# EAGLE design bus_breakout (EAGLE 6.1)
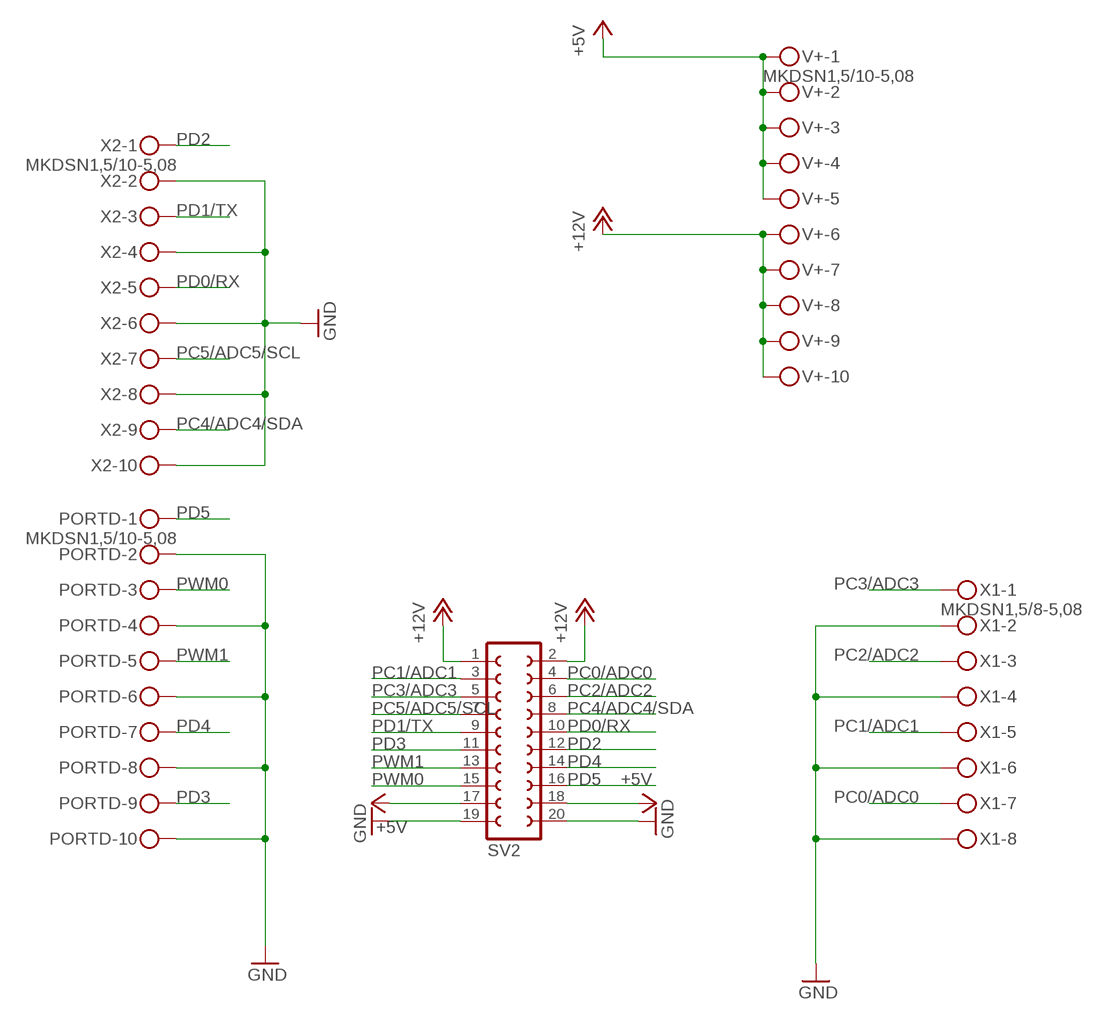
[diagram p0: schematic, sheet 1]

## Parts
PORTD  MKDSN1,5/10-5,08  [MKDSN1,5/10-5,08]
SV2  FE10-2  [FE10-2]
V+  MKDSN1,5/10-5,08  [MKDSN1,5/10-5,08]
X1  MKDSN1,5/8-5,08  [MKDSN1,5/8-5,08]
X2  MKDSN1,5/10-5,08  [MKDSN1,5/10-5,08]

## Nets
+5V: SV2.17 SV2.18 V+.1 V+.2 V+.3 V+.4 V+.5
+12V: SV2.1 SV2.2 V+.6 V+.7 V+.8 V+.9 V+.10
GND: PORTD.2 PORTD.4 PORTD.6 PORTD.8 PORTD.10 SV2.19 SV2.20 X1.2 X1.4 X1.6 X1.8 X2.2 X2.4 X2.6 X2.8 X2.10
PC0/ADC0: SV2.4 X1.7
PC1/ADC1: SV2.3 X1.5
PC2/ADC2: SV2.6 X1.3
PC3/ADC3: SV2.5 X1.1
PC4/ADC4/SDA: SV2.8 X2.9
PC5/ADC5/SCL: SV2.7 X2.7
PD0/RX: SV2.10 X2.5
PD1/TX: SV2.9 X2.3
PD2: SV2.12 X2.1
PD3: PORTD.9 SV2.11
PD4: PORTD.7 SV2.14
PD5: PORTD.1 SV2.16
PWM0: PORTD.3 SV2.15
PWM1: PORTD.5 SV2.13

## Library data of the parts
PORTD V+ X2 = con-phoenix-508:MKDSN1,5/10-5,08: MKDSN 1,5/10-5,08 Printklemme Nennstrom: 13,5 A Nennspannung: 250 V Rastermaß: 5,08 mm Polzahl: 10 Anschlussart: Schraubanschluss Montage: Löten Anschlussrichtung Leiter/Platine: 0 ° Artikelnummer: 1729209 Source: http://eshop.phoenixcontact.com .. 1729209.pdf; MPN: SMKDSN1,5/10-5,08; OC_FARNELL: 1792913; OC_NEWARK: 70R0297
SV2 = con-lsta:FE10-2: FEMALE HEADER; OC_FARNELL: unknown; OC_NEWARK: unknown
X1 = con-phoenix-508:MKDSN1,5/8-5,08: MKDSN 1,5/ 8-5,08 Printklemme Nennstrom: 13,5 A Nennspannung: 250 V Rastermaß: 5,08 mm Polzahl: 8 Anschlussart: Schraubanschluss Montage: Löten Anschlussrichtung Leiter/Platine: 0 ° Artikelnummer: 1729186 Source: http://eshop.phoenixcontact.com .. 1729186.pdf; MPN: SMKDSN1,5/8-5,08; OC_FARNELL: 1792911; OC_NEWARK: 70R0304

## Board
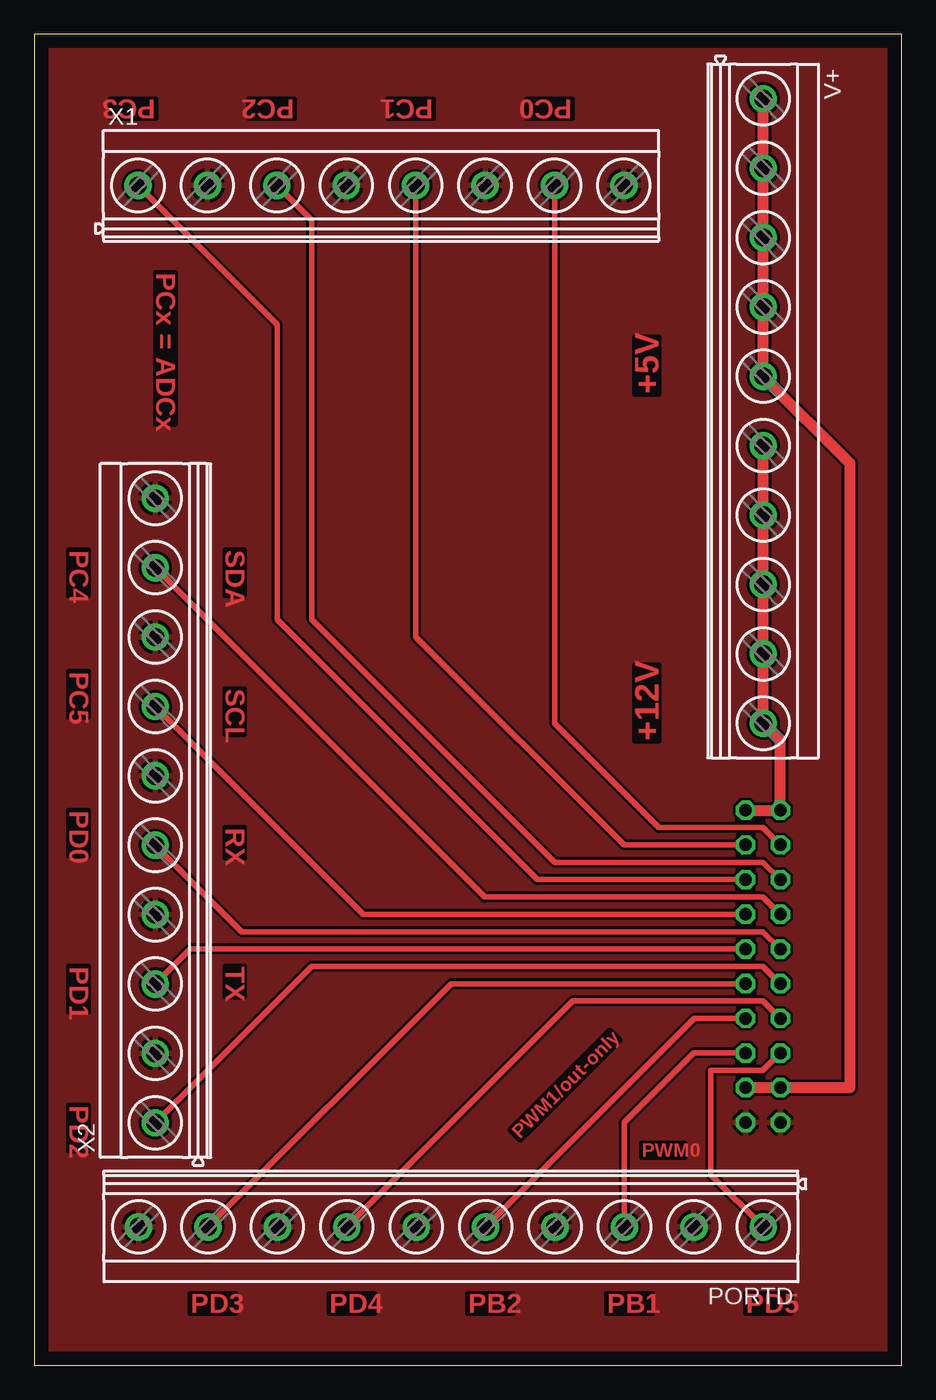
[diagram p1: board, top side]
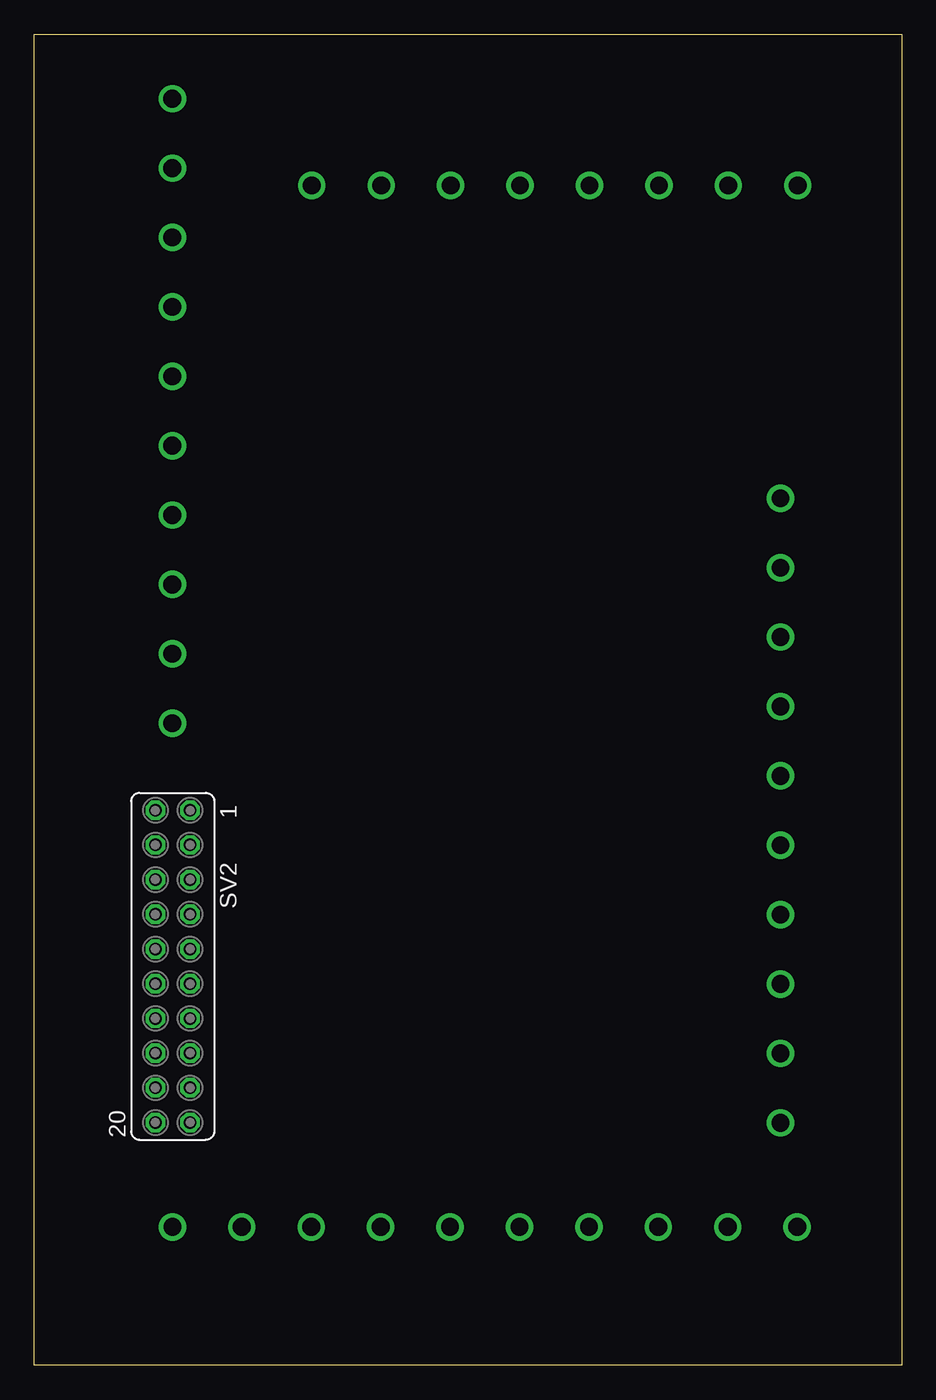
[diagram p2: board, bottom side, seen from below]

Size 63.48 x 97.46 mm. Coordinates in mm from the lower left corner, seen from the top.
Outline: 0,0 63.48,0 63.48,97.46 0,97.46 0,0
Copper layers (1*16): Top 0.035mm / dielectric 1.5mm / Bottom 0.035mm
Design rules: minimum track width 10mil, minimum drill 24mil, track to track 8mil, track to pad 8mil, pad to pad 8mil, via to via 8mil, smd to smd 8mil, copper to edge 40mil, drill to drill 8mil, minimum pad ring 10mil, minimum via ring 8mil, stop-mask expansion 4mil, vias tented up to drill 0mil, thermal gap 10mil

### Footprints (pad centres in the part's own frame; a part is rotated, then mirrored left to right if it is on the bottom)
MKDSN1,5/10-5,08 = drill 1.3 pad 2: 1 -22.881,0.025; 2 -17.801,0.025; 3 -12.721,0.025; 4 -7.641,0.025; 5 -2.561,0.025; 6 2.519,0.025; 7 7.599,0.025; 8 12.679,0.025; 9 17.759,0.025; 10 22.839,0.025
FE10-2 = drill 0.914 octagon: 1 -11.43,1.27; 2 -11.43,-1.27; 3 -8.89,1.27; 4 -8.89,-1.27; 5 -6.35,1.27; 6 -6.35,-1.27; 7 -3.81,1.27; 8 -3.81,-1.27; 9 -1.27,1.27; 10 -1.27,-1.27; 11 1.27,1.27; 12 1.27,-1.27; 13 3.81,1.27; 14 3.81,-1.27; 15 6.35,1.27; 16 6.35,-1.27; 17 8.89,1.27; 18 8.89,-1.27; 19 11.43,1.27; 20 11.43,-1.27
MKDSN1,5/8-5,08 = drill 1.3 pad 2: 1 -17.801,0.025; 2 -12.721,0.025; 3 -7.641,0.025; 4 -2.561,0.025; 5 2.519,0.025; 6 7.599,0.025; 7 12.679,0.025; 8 17.759,0.025

### Placement (x,y rotation side)
PORTD  30.48,10.16 180 top
SV2  53.34,29.21 270 bottom
V+  53.34,69.85 270 top
X1  25.4,86.36 0 top
X2  8.89,40.64 90 top

### Tracks (layer width: path | path; a pad name or v marks a point on that pad's centre or on a via)
+5V
  Top 0.813: SV2.17 SV2.18 59.69,20.32 59.69,66.04 53.37,72.36 V+.5 V+.4 V+.3 V+.2 V+.1
+12V
  Top 0.813: SV2.1 SV2.2 54.61,45.77 V+.10 V+.9 V+.8 V+.7 V+.6
GND
  pour Top: -1.27,100.33 -1.27,-1.27 66.04,-1.27 66.04,100.33
PC0/ADC0
  Top 0.406: SV2.4 53.34,39.37 45.72,39.37 38.1,46.99 38.1,86.36 X1.7
PC1/ADC1
  Top 0.406: SV2.3 43.18,38.1 27.94,53.34 27.94,86.36 X1.5
PC2/ADC2
  Top 0.406: SV2.6 53.34,36.83 38.1,36.83 20.32,54.61 20.32,83.82 X1.3
PC3/ADC3
  Top 0.406: SV2.5 36.83,35.56 17.78,54.61 17.78,76.2 X1.1
PC4/ADC4/SDA
  Top 0.406: SV2.8 53.34,34.29 32.97,34.29 X2.9
PC5/ADC5/SCL
  Top 0.406: SV2.7 24.08,33.02 X2.7
PD0/RX
  Top 0.406: SV2.10 53.34,31.75 15.19,31.75 X2.5
PD1/TX
  Top 0.406: SV2.9 11.43,30.48 X2.3
PD2
  Top 0.406: SV2.12 53.34,29.21 20.32,29.21 X2.1
PD3
  Top 0.406: SV2.11 30.53,27.94 PORTD.9
PD4
  Top 0.406: SV2.14 53.34,26.67 39.42,26.67 PORTD.7
PD5
  Top 0.406: SV2.16 53.34,21.59 49.53,21.59 49.53,13.97 PORTD.1
PWM0
  Top 0.406: SV2.15 48.26,22.86 43.18,17.78 43.18,10.16 PORTD.3
PWM1
  Top 0.406: SV2.13 48.31,25.4 PORTD.5

### Text on the board
Top: PC3 | PC2 | PC1 | PC0 | PCx = ADCx | +5V | PC4 | SDA | PC5 | SCL | +12V | PD0 | RX | PD1 | TX | PD2 | PWM1/out-only | PWM0 | PD3 | PD4 | PB2 | PB1 | PD5